# Altium schematic sheet Backplane PCB Breakout Connector.SchDoc: BACKPLANE PCB BREAKOUT CONNECTOR
size B; CompanyName: ENGINEERING & TECHNICAL SERVICES; DrawnBy: C. Kornowski; Engineer: C. Kornowski; Organization: TECHNOLOGY DEVELOPMENT & ENGINEERING CENTER; Address1: 11401 HOOVER ROAD; Address2: MILAN, OH  44846; DocumentNumber: RD17-7000; Revision: INIT; SheetNumber: 3; SheetTotal: 5; PageSetup: Record=PageOptions|CenterHorizontal=True|CenterVertical=True|PrintScale=1.09|XCorrection=1.00|YCorrection=1.00|PrintKind=1|BorderSize=5000000|LeftOffset=0|BottomOffset=0|Orientation=2|PaperLength=1000|PaperWidth=1000|Scale=100|PaperSource=7|PrintQuality=600|MediaType=1|DitherType=10|PaperKind=11x17|PrintScaleMode=1
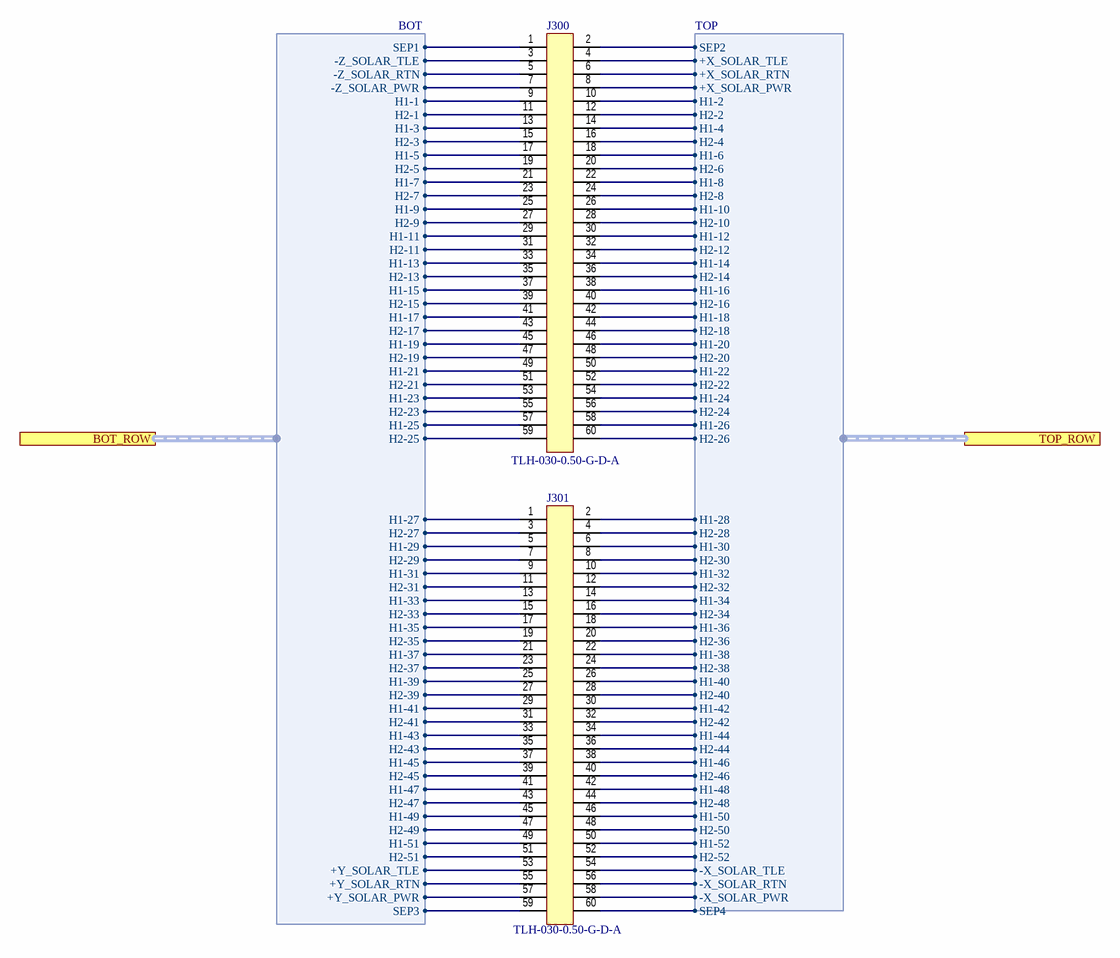
[diagram p0: Backplane PCB Breakout Connector.SchDoc]

## Parts
J300  TLH-030-0.50-G-D-A  [TLH-030-0.50-G-D-A]
J301  TLH-030-0.50-G-D-A  [TLH-030-0.50-G-D-A]

## Ports
BOT_ROW (harness BOT), TOP_ROW (harness TOP)

## Harnesses
BOT: H1-1, H2-1, H1-3, H2-3, H1-5, H2-5, H1-7, H2-7, H1-9, H2-9, H1-11, H2-11, H1-13, H2-13, H1-15, H2-15, H1-17, H2-17, H1-19, H2-19, H1-21, H2-21, H1-23, H2-23, H1-25, H2-25, H1-27, H2-27, H1-29, H2-29, H1-31, H2-31, H2-33, H1-33, H2-35, H1-35, H2-37, H1-37, H2-39, H1-39, H2-41, H1-41, H2-43, H1-43, H2-45, H1-45, H2-47, H1-47, H2-49, H1-49, H2-51, H1-51, SEP1, SEP3, +Y_SOLAR_PWR, +Y_SOLAR_RTN, +Y_SOLAR_TLE, -Z_SOLAR_PWR, -Z_SOLAR_RTN, -Z_SOLAR_TLE
TOP: H1-2, H2-2, H1-4, H2-4, H1-6, H2-6, H1-8, H2-8, H1-10, H2-10, H1-12, H2-12, H1-14, H2-14, H1-16, H2-16, H1-18, H2-18, H1-20, H2-20, H1-22, H2-22, H1-24, H2-24, H1-26, H2-26, H1-28, H2-28, H1-30, H2-30, H2-32, H1-32, H2-34, H1-34, H2-36, H1-36, H2-38, H1-38, H2-40, H1-40, H2-42, H1-42, H2-44, H1-44, H2-46, H1-46, H2-48, H1-48, H2-50, H1-50, H2-52, H1-52, SEP2, SEP4, -X_SOLAR_PWR, -X_SOLAR_RTN, -X_SOLAR_TLE, +X_SOLAR_TLE, +X_SOLAR_RTN, +X_SOLAR_PWR

## Nets
NetJ300_1: J300.1 ; port BOT_ROW.SEP1
NetJ300_2: J300.2 ; port TOP_ROW.SEP2
NetJ300_3: J300.3 ; port BOT_ROW.-Z_SOLAR_TLE
NetJ300_4: J300.4 ; port TOP_ROW.+X_SOLAR_TLE
NetJ300_5: J300.5 ; port BOT_ROW.-Z_SOLAR_RTN
NetJ300_6: J300.6 ; port TOP_ROW.+X_SOLAR_RTN
NetJ300_7: J300.7 ; port BOT_ROW.-Z_SOLAR_PWR
NetJ300_8: J300.8 ; port TOP_ROW.+X_SOLAR_PWR
NetJ300_9: J300.9 ; port BOT_ROW.H1-1
NetJ300_10: J300.10 ; port TOP_ROW.H1-2
NetJ300_11: J300.11 ; port BOT_ROW.H2-1
NetJ300_12: J300.12 ; port TOP_ROW.H2-2
NetJ300_13: J300.13 ; port BOT_ROW.H1-3
NetJ300_14: J300.14 ; port TOP_ROW.H1-4
NetJ300_15: J300.15 ; port BOT_ROW.H2-3
NetJ300_16: J300.16 ; port TOP_ROW.H2-4
NetJ300_17: J300.17 ; port BOT_ROW.H1-5
NetJ300_18: J300.18 ; port TOP_ROW.H1-6
NetJ300_19: J300.19 ; port BOT_ROW.H2-5
NetJ300_20: J300.20 ; port TOP_ROW.H2-6
NetJ300_21: J300.21 ; port BOT_ROW.H1-7
NetJ300_22: J300.22 ; port TOP_ROW.H1-8
NetJ300_23: J300.23 ; port BOT_ROW.H2-7
NetJ300_24: J300.24 ; port TOP_ROW.H2-8
NetJ300_25: J300.25 ; port BOT_ROW.H1-9
NetJ300_26: J300.26 ; port TOP_ROW.H1-10
NetJ300_27: J300.27 ; port BOT_ROW.H2-9
NetJ300_28: J300.28 ; port TOP_ROW.H2-10
NetJ300_29: J300.29 ; port BOT_ROW.H1-11
NetJ300_30: J300.30 ; port TOP_ROW.H1-12
NetJ300_31: J300.31 ; port BOT_ROW.H2-11
NetJ300_32: J300.32 ; port TOP_ROW.H2-12
NetJ300_33: J300.33 ; port BOT_ROW.H1-13
NetJ300_34: J300.34 ; port TOP_ROW.H1-14
NetJ300_35: J300.35 ; port BOT_ROW.H2-13
NetJ300_36: J300.36 ; port TOP_ROW.H2-14
NetJ300_37: J300.37 ; port BOT_ROW.H1-15
NetJ300_38: J300.38 ; port TOP_ROW.H1-16
NetJ300_39: J300.39 ; port BOT_ROW.H2-15
NetJ300_40: J300.40 ; port TOP_ROW.H2-16
NetJ300_41: J300.41 ; port BOT_ROW.H1-17
NetJ300_42: J300.42 ; port TOP_ROW.H1-18
NetJ300_43: J300.43 ; port BOT_ROW.H2-17
NetJ300_44: J300.44 ; port TOP_ROW.H2-18
NetJ300_45: J300.45 ; port BOT_ROW.H1-19
NetJ300_46: J300.46 ; port TOP_ROW.H1-20
NetJ300_47: J300.47 ; port BOT_ROW.H2-19
NetJ300_48: J300.48 ; port TOP_ROW.H2-20
NetJ300_49: J300.49 ; port BOT_ROW.H1-21
NetJ300_50: J300.50 ; port TOP_ROW.H1-22
NetJ300_51: J300.51 ; port BOT_ROW.H2-21
NetJ300_52: J300.52 ; port TOP_ROW.H2-22
NetJ300_53: J300.53 ; port BOT_ROW.H1-23
NetJ300_54: J300.54 ; port TOP_ROW.H1-24
NetJ300_55: J300.55 ; port BOT_ROW.H2-23
NetJ300_56: J300.56 ; port TOP_ROW.H2-24
NetJ300_57: J300.57 ; port BOT_ROW.H1-25
NetJ300_58: J300.58 ; port TOP_ROW.H1-26
NetJ300_59: J300.59 ; port BOT_ROW.H2-25
NetJ300_60: J300.60 ; port TOP_ROW.H2-26
NetJ301_1: J301.1 ; port BOT_ROW.H1-27
NetJ301_2: J301.2 ; port TOP_ROW.H1-28
NetJ301_3: J301.3 ; port BOT_ROW.H2-27
NetJ301_4: J301.4 ; port TOP_ROW.H2-28
NetJ301_5: J301.5 ; port BOT_ROW.H1-29
NetJ301_6: J301.6 ; port TOP_ROW.H1-30
NetJ301_7: J301.7 ; port BOT_ROW.H2-29
NetJ301_8: J301.8 ; port TOP_ROW.H2-30
NetJ301_9: J301.9 ; port BOT_ROW.H1-31
NetJ301_10: J301.10 ; port TOP_ROW.H1-32
NetJ301_11: J301.11 ; port BOT_ROW.H2-31
NetJ301_12: J301.12 ; port TOP_ROW.H2-32
NetJ301_13: J301.13 ; port BOT_ROW.H1-33
NetJ301_14: J301.14 ; port TOP_ROW.H1-34
NetJ301_15: J301.15 ; port BOT_ROW.H2-33
NetJ301_16: J301.16 ; port TOP_ROW.H2-34
NetJ301_17: J301.17 ; port BOT_ROW.H1-35
NetJ301_18: J301.18 ; port TOP_ROW.H1-36
NetJ301_19: J301.19 ; port BOT_ROW.H2-35
NetJ301_20: J301.20 ; port TOP_ROW.H2-36
NetJ301_21: J301.21 ; port BOT_ROW.H1-37
NetJ301_22: J301.22 ; port TOP_ROW.H1-38
NetJ301_23: J301.23 ; port BOT_ROW.H2-37
NetJ301_24: J301.24 ; port TOP_ROW.H2-38
NetJ301_25: J301.25 ; port BOT_ROW.H1-39
NetJ301_26: J301.26 ; port TOP_ROW.H1-40
NetJ301_27: J301.27 ; port BOT_ROW.H2-39
NetJ301_28: J301.28 ; port TOP_ROW.H2-40
NetJ301_29: J301.29 ; port BOT_ROW.H1-41
NetJ301_30: J301.30 ; port TOP_ROW.H1-42
NetJ301_31: J301.31 ; port BOT_ROW.H2-41
NetJ301_32: J301.32 ; port TOP_ROW.H2-42
NetJ301_33: J301.33 ; port BOT_ROW.H1-43
NetJ301_34: J301.34 ; port TOP_ROW.H1-44
NetJ301_35: J301.35 ; port BOT_ROW.H2-43
NetJ301_36: J301.36 ; port TOP_ROW.H2-44
NetJ301_37: J301.37 ; port BOT_ROW.H1-45
NetJ301_38: J301.38 ; port TOP_ROW.H1-46
NetJ301_39: J301.39 ; port BOT_ROW.H2-45
NetJ301_40: J301.40 ; port TOP_ROW.H2-46
NetJ301_41: J301.41 ; port BOT_ROW.H1-47
NetJ301_42: J301.42 ; port TOP_ROW.H1-48
NetJ301_43: J301.43 ; port BOT_ROW.H2-47
NetJ301_44: J301.44 ; port TOP_ROW.H2-48
NetJ301_45: J301.45 ; port BOT_ROW.H1-49
NetJ301_46: J301.46 ; port TOP_ROW.H1-50
NetJ301_47: J301.47 ; port BOT_ROW.H2-49
NetJ301_48: J301.48 ; port TOP_ROW.H2-50
NetJ301_49: J301.49 ; port BOT_ROW.H1-51
NetJ301_50: J301.50 ; port TOP_ROW.H1-52
NetJ301_51: J301.51 ; port BOT_ROW.H2-51
NetJ301_52: J301.52 ; port TOP_ROW.H2-52
NetJ301_53: J301.53 ; port BOT_ROW.+Y_SOLAR_TLE
NetJ301_54: J301.54 ; port TOP_ROW.-X_SOLAR_TLE
NetJ301_55: J301.55 ; port BOT_ROW.+Y_SOLAR_RTN
NetJ301_56: J301.56 ; port TOP_ROW.-X_SOLAR_RTN
NetJ301_57: J301.57 ; port BOT_ROW.+Y_SOLAR_PWR
NetJ301_58: J301.58 ; port TOP_ROW.-X_SOLAR_PWR
NetJ301_59: J301.59 ; port BOT_ROW.SEP3
NetJ301_60: J301.60 ; port TOP_ROW.SEP4

## Notes on the sheet
- DCN
- REV
- DESCRIPTION
- REVISION HISTORY
- DATE
- APPROVED
- SIZE
- TITLE
- CAGE CODE
- DWG NO.
- DRAWN BY
- B
- 01HY9
- ENGINEER
- FILE NAME
- SHEET
- PRINTED:
- OF

## Library data of the parts
J300 J301 = TLH-030-0.50-G-D-A: Board to Board & Mezzanine Connectors 0.50 mm Razor Beam LP Ultra Low Profile Terminal Strip; Manufacturer 1: Samtec; Supplier 1: Avnet; Supplier Part Number 1: TLH-030-0.50-G-D-A; Stock 1: 0; Pricing 1: 1=4.48781, 10=4.38095, 25=4.28572, 50=4.18816, 100=3.93162 (USD); RoHS: No; Manufacturer Part Number 1: TLH-030-0.50-G-D-A; System: Connector